# EAGLE schematic coil-control-module-v2 (EAGLE 7.4.0)
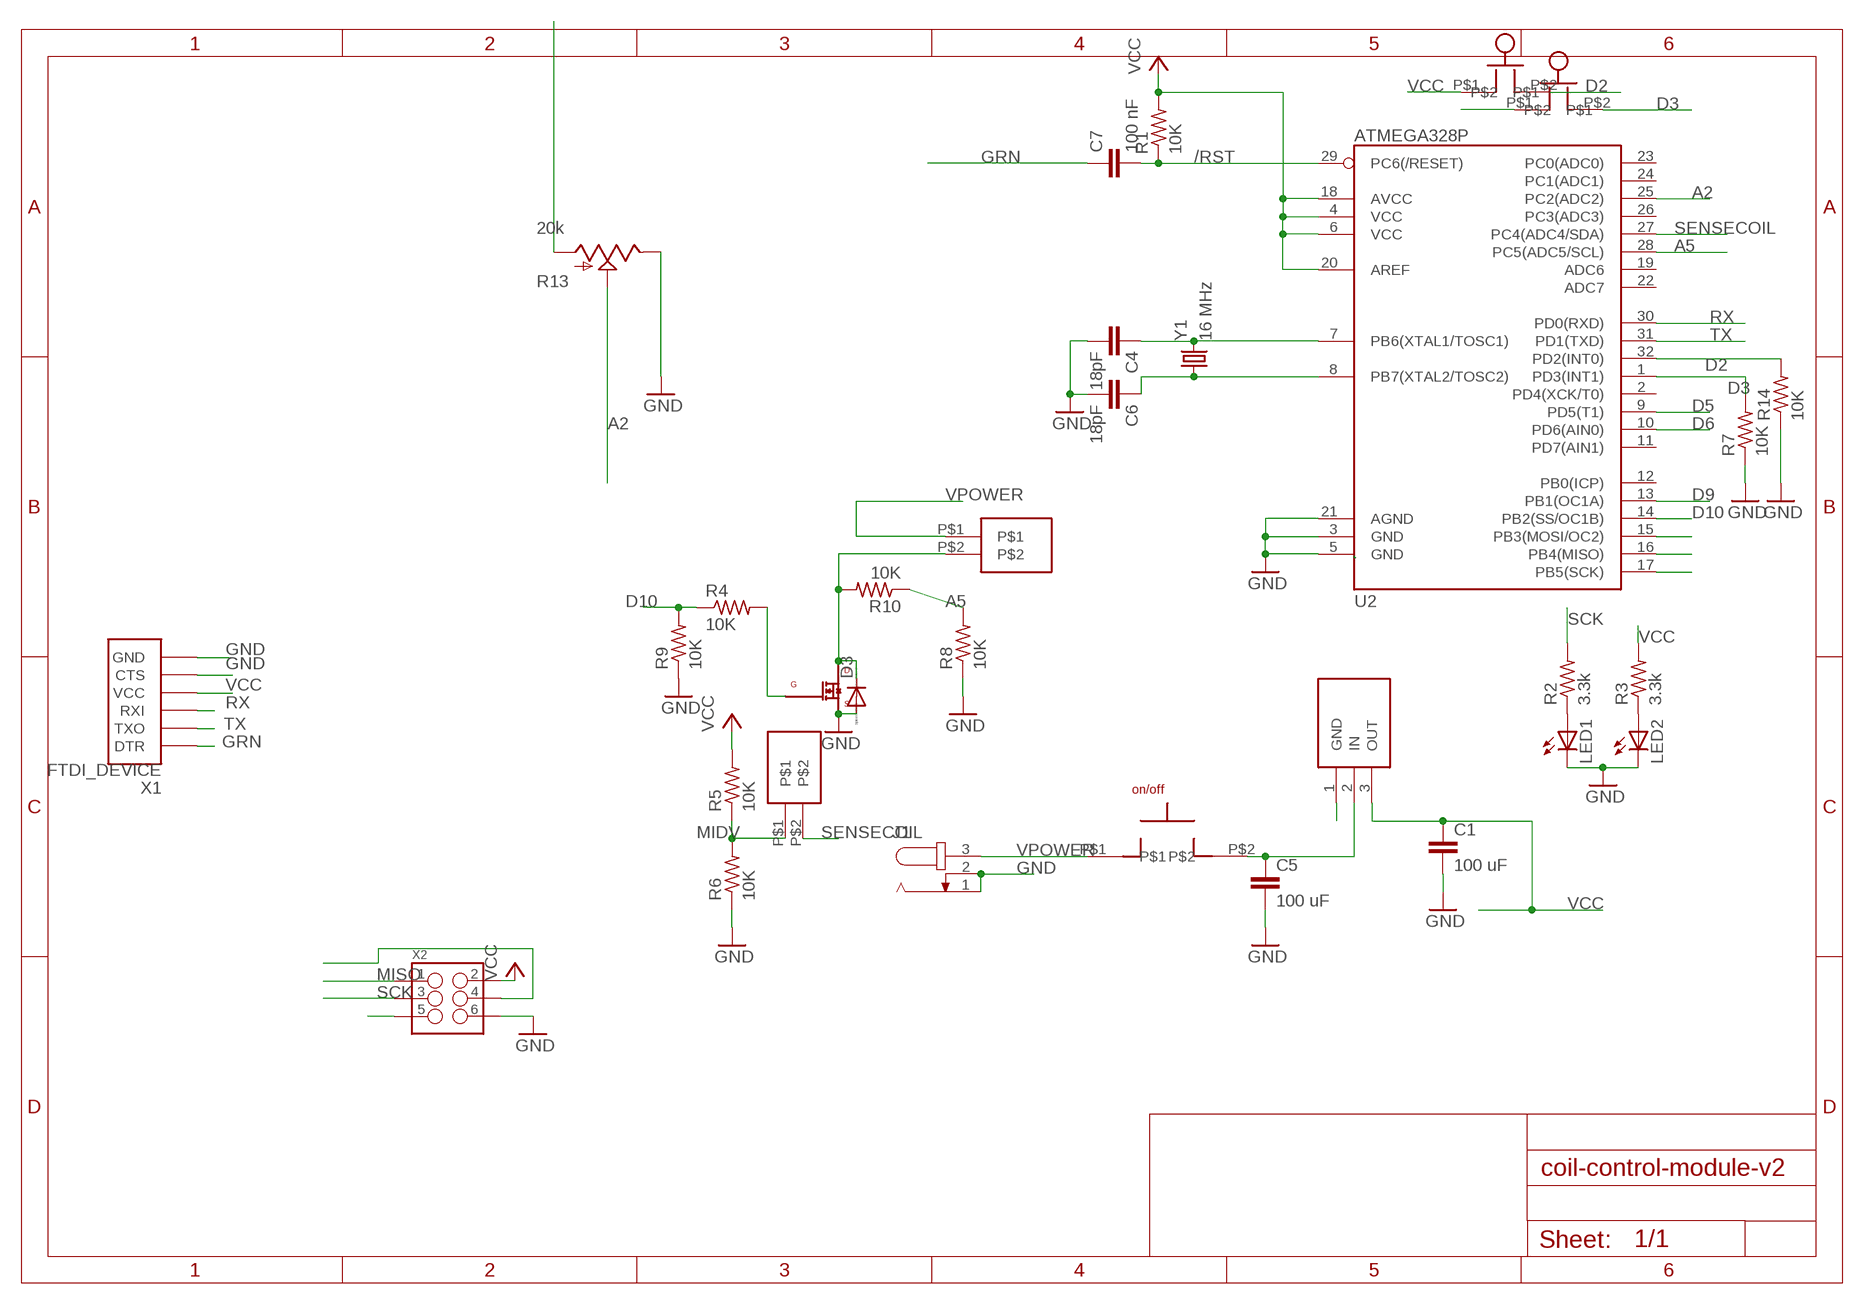
[diagram p0: schematic, sheet 1]

## Parts
C1  100 uF  CAP1206  [1206]
C4  18pF  C-EUC0603  [C0603]
C5  100 uF  CAP1206  [1206]
C6  18pF  C-EUC0603  [C0603]
C7  100 nF  CAP0603-CAP  [0603-CAP]
D3  DIODE-DO-214AC  [DO-214AC]
J1  JACK-PLUG1  [SPC4078]
LED1  LEDSML0603  [SML0603]
LED2  LEDSML0603  [SML0603]
R1  10K  R-US_R0603  [R0603]
R2  3.3k  R-US_R0603  [R0603]
R3  3.3k  R-US_R0603  [R0603]
R4  10K  R-US_R0603  [R0603]
R5  10K  R-US_R0603  [R0603]
R6  10K  R-US_R0603  [R0603]
R7  10K  R-US_R0603  [R0603]
R8  10K  R-US_R0603  [R0603]
R9  10K  R-US_R0603  [R0603]
R10  10K  R-US_R0603  [R0603]
R13  20k  POTALPS-KIT  [ALPS_POT_KIT]
R14  10K  R-US_R0603  [R0603]
U2  ATMEGA328P  ATMEGA328_SMT  [TQFP32-08]
U$1  CW182-ND  [CW182-ND]
U$2  MCP1700  [TO92-3]
U$3  SPRING-TERMINAL  [SPRING-TERMINAL]
U$4  BUTTON  [BUTTON]
U$6  IRLML0060  [SOT-23]
U$7  BUTTON  [BUTTON]
U$8  SPRING-TERMINAL  [SPRING-TERMINAL]
X1  FTDI_DEVICE  [FTDI_DEVICE_SIDE]
X2  M03X2NO_SILK  [2X3-NS]
Y1  16 MHz  CRYSTAL5X3  [CRYSTAL-SMD-5X3]

## Nets
/RST: C7.2 R1.1 U2.29(PC6(/RESET)) X2.5
A2: R13.P$2(S) U2.25(PC2(ADC2))
A5: R8.2 R10.1 U2.28(PC5(ADC5/SCL))
D2: R14.2 U2.32(PD2(INT0)) U$7.P$2
D3: R7.2 U2.1(PD3(INT1)) U$4.P$2
D5: U2.9(PD5(T1))
D6: U2.10(PD6(AIN0))
D9: U2.13(PB1(OC1A))
D10: R4.1 R9.2 U2.14(PB2(SS/OC1B))
GND: C1.2 C4.2 C5.2 C6.2 D3.A J1.1 J1.2 LED1.C LED2.C R6.1 R7.1 R8.1 R9.1 R13.P$1(E) R14.1 U2.3(GND) U2.5(GND) U2.21(AGND) U$2.1(GND) U$6.2(SOURCE) X1.P$5(CTS) X1.P$6(GND) X2.6
GRN: C7.1 X1.P$1(DTR)
MIDV: R5.1 R6.2 U$3.P$1
MISO: U2.16(PB4(MISO)) X2.1
MOSI: U2.15(PB3(MOSI/OC2)) X2.4
N$3: D3.C R10.2 U$6.3(DRAIN) U$8.P$2
N$4: C4.1 U2.7(PB6(XTAL1/TOSC1)) Y1.3
N$10: LED1.A R2.1
N$11: C6.1 U2.8(PB7(XTAL2/TOSC2)) Y1.1
N$13: LED2.A R3.1
N$27: R4.2 U$6.1(GATE)
RX: U2.30(PD0(RXD)) X1.P$3(RXI)
SCK: R2.2 U2.17(PB5(SCK)) X2.3
SENSECOIL: U2.27(PC4(ADC4/SDA)) U$3.P$2
TX: U2.31(PD1(TXD)) X1.P$2(TXO)
VCC: C1.1 R1.2 R3.2 R5.2 R13.P$3(A) U2.4(VCC) U2.6(VCC) U2.18(AVCC) U2.20(AREF) U$2.3(OUT) U$7.P$1 X1.P$4(VCC) X2.2
VIN: C5.1 U$1.P$2 U$2.2(IN)
VPOWER: J1.3 U$1.P$1 U$8.P$1
Unconnected: U2.2(PD4(XCK/T0)) U2.11(PD7(AIN1)) U2.12(PB0(ICP)) U2.19(ADC6) U2.22(ADC7) U2.23(PC0(ADC0)) U2.24(PC1(ADC1)) U2.26(PC3(ADC3)) U$4.P$1

## Library data of the parts
C1 C5 = SparkFun-Capacitors:CAP: Capacitor Standard 0603 ceramic capacitor, and 0.1" leaded capacitor.
C4 C6 = resistor:C-EU: CAPACITOR, European symbol
C7 = SparkFun-Passives:CAP: Capacitor Standard 0603 ceramic capacitor, and 0.1" leaded capacitor.
D3 = diode:DIODE-: DIODE
J1 = con-jack:JACK-PLUG: DC POWER JACK Power Jack, DC, Right Angle, Through Hole, Rated 5A at 16VDC, PC Terminals Distributor: Farnell (www.Farnell.de) Drawing: 84N1161.pdf / 84N1162.pdf Manufacturer: SPC Technology (www.spctechnology.com) Type: SPC4077 / SPC 4078; OC_FARNELL: unknown; OC_NEWARK: unknown
LED1 LED2 = led:LED: LED OSRAM: - CHIPLED LG R971, LG N971, LY N971, LG Q971, LY Q971, LO R971, LY R971 LH N974, LH R974 LS Q976, LO Q976, LY Q976 LO Q996 - Hyper CHIPLED LW Q18S LB Q993, LB Q99A, LB R99A - SideLED LS A670, LO A670, LY A670, LG A670, LP A670 LB A673, LV A673, LT A673, LW A673 LH A674 LY A675 LS A676, LA A676, LO A676, LY A676, LW A676 LS A679, LY A679, LG A679 - Hyper Micro SIDELED® LS Y876, LA Y876, LO Y876, LY Y876 LT Y87S - SmartLED LW L88C, LW L88S LB L89C, LB L89S, LG L890 LS L89K, LO L89K, LY L89K LS L896, LA L896, LO L896, LY L896 - TOPLED LS T670, LO T670, LY T670, LG T670, LP T670 LSG T670, LSP T670, LSY T670, LOP T670, LYG T670 LG T671, LOG T671, LSG T671 LB T673, LV T673, LT T673, LW T673 LH T674 LS T676, LA T676, LO T676, LY T676, LB T676, LH T676, LSB T676, LW T676 LB T67C, LV T67C, LT T67C, LS T67K, LO T67K, LY T67K, LW E67C LS E67B, LA E67B, LO E67B, LY E67B, LB E67C, LV E67C, LT E67C LW T67C LS T679, LY T679, LG T679 LS T770, LO T770, LY T770, LG T770, LP T770 LB T773, LV T773, LT T773, LW T773 LH T774 LS E675, LA E675, LY E675, LS T675 LS T776, LA T776, LO T776, LY T776, LB T776 LHGB T686 LT T68C, LB T68C - Hyper Mini TOPLED® LB M676 - Mini TOPLED Santana® LG M470 LS M47K, LO M47K, LY M47K Source: http://www.osram.convergy.de LUXEON: - LUMILED® LXK2-PW12-R00, LXK2-PW12-S00, LXK2-PW14-U00, LXK2-PW14-V00 LXK2-PM12-R00, LXK2-PM12-S00, LXK2-PM14-U00 LXK2-PE12-Q00, LXK2-PE12-R00, LXK2-PE12-S00, LXK2-PE14-T00, LXK2-PE14-U00 LXK2-PB12-K00, LXK2-PB12-L00, LXK2-PB12-M00, LXK2-PB14-N00, LXK2-PB14-P00, LXK2-PB14-Q00 LXK2-PR12-L00, LXK2-PR12-M00, LXK2-PR14-Q00, LXK2-PR14-R00 LXK2-PD12-Q00, LXK2-PD12-R00, LXK2-PD12-S00 LXK2-PH12-R00, LXK2-PH12-S00 LXK2-PL12-P00, LXK2-PL12-Q00, LXK2-PL12-R00 Source: www.luxeon.com KINGBRIGHT: KA-3528ASYC Source: www.kingbright.com
R1-R10 R14 = resistor:R-US_: RESISTOR, American symbol
R13 = SparkFun-Electromechanical:POT
U2 = SparkFun-DigitalIC:ATMEGA328_SMT: 32-Pin Atmega328 part Commonly used on Arduino compatible boards Available in QFP and QFN packages TQFP is IC-09069 QFN is non-stock; PROD_ID: IC-09069
U$1 = spietz-library:CW182-ND
U$2 = spietz-library:MCP1700
U$3 U$8 = spietz-library:SPRING-TERMINAL
U$4 U$7 = spietz-library:BUTTON
U$6 = spietz-library:IRLML0060
X1 = SparkFun-Connectors:FTDI_DEVICE: Connector which mates to FTDI basic or FTDI cable.
X2 = SparkFun-Connectors:M03X2: 2x3 .1" header. Shrouded, with keying- CONN-10681 SMT- CONN-11415 Pogo pins- HW-11044
Y1 = SparkFun-FreqCtrl:CRYSTAL: Various standard crystals. Proven footprints. Spark Fun Electronics SKU : COM-00534

## Net classes
1 vcc: width 0.254 mm